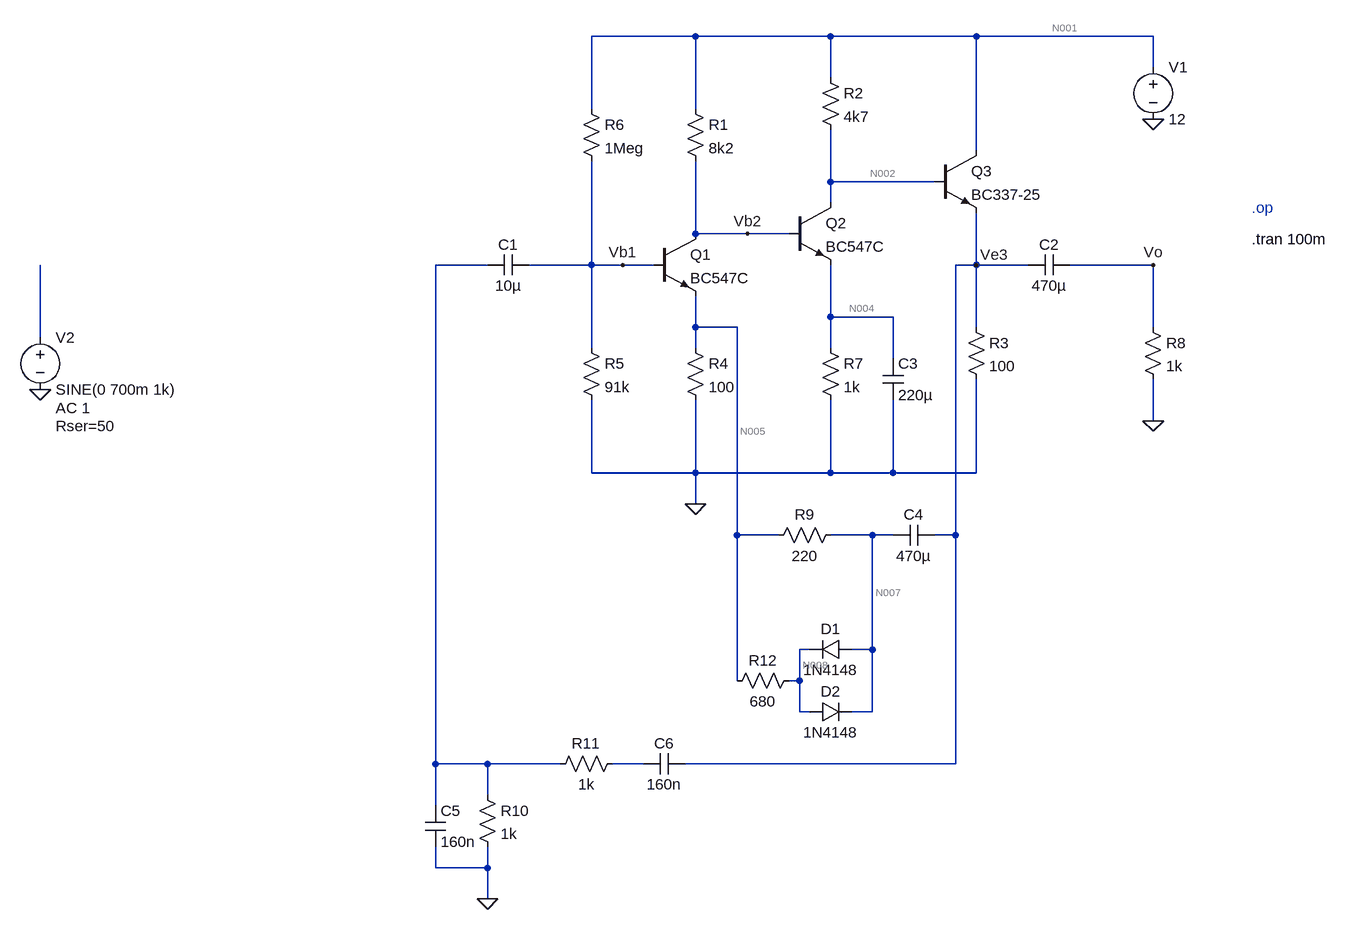
[diagram p0: schematic oscilador wien con bjts.asc]
oscilador wien con bjts.asc, the LTspice schematic file:
Version 4
SHEET 1 1052 1172
WIRE 64 -176 -96 -176
WIRE 272 -176 64 -176
WIRE 496 -176 272 -176
WIRE 768 -176 496 -176
WIRE 768 -128 768 -176
WIRE 272 -112 272 -176
WIRE -96 -64 -96 -176
WIRE 64 -64 64 -176
WIRE 496 0 496 -176
WIRE 272 48 272 -32
WIRE 432 48 272 48
WIRE 272 80 272 48
WIRE 64 128 64 16
WIRE 144 128 64 128
WIRE 208 128 144 128
WIRE -256 176 -336 176
WIRE -96 176 -96 16
WIRE -96 176 -192 176
WIRE -48 176 -96 176
WIRE 0 176 -48 176
WIRE 496 176 496 96
WIRE 496 176 464 176
WIRE 576 176 496 176
WIRE 768 176 640 176
WIRE 272 256 272 176
WIRE 368 256 272 256
WIRE 64 272 64 224
WIRE 128 272 64 272
WIRE 496 272 496 176
WIRE 768 272 768 176
WIRE -944 288 -944 176
WIRE -96 304 -96 176
WIRE 64 304 64 272
WIRE 272 304 272 256
WIRE 368 320 368 256
WIRE 768 416 768 352
WIRE -96 496 -96 384
WIRE 64 496 64 384
WIRE 64 496 -96 496
WIRE 272 496 272 384
WIRE 272 496 64 496
WIRE 368 496 368 384
WIRE 368 496 272 496
WIRE 496 496 496 352
WIRE 496 496 368 496
WIRE 64 544 64 496
WIRE 128 592 128 272
WIRE 192 592 128 592
WIRE 336 592 272 592
WIRE 368 592 336 592
WIRE 464 592 464 176
WIRE 464 592 432 592
WIRE 240 768 224 768
WIRE 336 768 336 592
WIRE 336 768 304 768
WIRE 128 816 128 592
WIRE 224 816 224 768
WIRE 224 816 208 816
WIRE 224 864 224 816
WIRE 240 864 224 864
WIRE 336 864 336 768
WIRE 336 864 304 864
WIRE -336 944 -336 176
WIRE -256 944 -336 944
WIRE -144 944 -256 944
WIRE -16 944 -64 944
WIRE 464 944 464 592
WIRE 464 944 48 944
WIRE -256 992 -256 944
WIRE -336 1008 -336 944
WIRE -336 1104 -336 1072
WIRE -256 1104 -256 1072
WIRE -256 1104 -336 1104
WIRE -256 1152 -256 1104
FLAG 768 -48 0
FLAG 64 544 0
FLAG -48 176 Vb1
FLAG 144 128 Vb2
FLAG 496 176 Ve3
FLAG -944 368 0
FLAG 768 416 0
FLAG 768 176 Vo
FLAG -256 1152 0
SYMBOL npn 0 128 R0
SYMATTR InstName Q1
SYMATTR Value BC547C
SYMBOL npn 208 80 R0
SYMATTR InstName Q2
SYMATTR Value BC547C
SYMBOL npn 432 0 R0
SYMATTR InstName Q3
SYMATTR Value BC337-25
SYMBOL res 48 -80 R0
SYMATTR InstName R1
SYMATTR Value 8k2
SYMBOL res 256 -128 R0
SYMATTR InstName R2
SYMATTR Value 4k7
SYMBOL res 480 256 R0
SYMATTR InstName R3
SYMATTR Value 100
SYMBOL res 48 288 R0
SYMATTR InstName R4
SYMATTR Value 100
SYMBOL res -112 288 R0
SYMATTR InstName R5
SYMATTR Value 91k
SYMBOL res -112 -80 R0
SYMATTR InstName R6
SYMATTR Value 1Meg
SYMBOL res 256 288 R0
SYMATTR InstName R7
SYMATTR Value 1k
SYMBOL voltage 768 -144 R0
WINDOW 123 0 0 Left 0
WINDOW 39 0 0 Left 0
SYMATTR InstName V1
SYMATTR Value 12
SYMBOL cap -192 160 R90
WINDOW 0 0 32 VBottom 2
WINDOW 3 32 32 VTop 2
SYMATTR InstName C1
SYMATTR Value 10µ
SYMBOL cap 640 160 R90
WINDOW 0 0 32 VBottom 2
WINDOW 3 32 32 VTop 2
SYMATTR InstName C2
SYMATTR Value 470µ
SYMBOL res 752 256 R0
SYMATTR InstName R8
SYMATTR Value 1k
SYMBOL voltage -944 272 R0
WINDOW 123 24 124 Left 2
WINDOW 39 24 152 Left 2
SYMATTR InstName V2
SYMATTR Value SINE(0 700m 1k)
SYMATTR Value2 AC 1
SYMATTR SpiceLine Rser=50
SYMBOL cap 352 320 R0
SYMATTR InstName C3
SYMATTR Value 220µ
SYMBOL res 288 576 R90
WINDOW 0 0 56 VBottom 2
WINDOW 3 32 56 VTop 2
SYMATTR InstName R9
SYMATTR Value 220
SYMBOL cap 432 576 R90
WINDOW 0 0 32 VBottom 2
WINDOW 3 32 32 VTop 2
SYMATTR InstName C4
SYMATTR Value 470µ
SYMBOL res -272 976 R0
SYMATTR InstName R10
SYMATTR Value 1k
SYMBOL res -48 928 R90
WINDOW 0 0 56 VBottom 2
WINDOW 3 32 56 VTop 2
SYMATTR InstName R11
SYMATTR Value 1k
SYMBOL cap -352 1008 R0
SYMATTR InstName C5
SYMATTR Value 160n
SYMBOL cap 48 928 R90
WINDOW 0 0 32 VBottom 2
WINDOW 3 32 32 VTop 2
SYMATTR InstName C6
SYMATTR Value 160n
SYMBOL diode 304 752 R90
WINDOW 0 0 32 VBottom 2
WINDOW 3 32 32 VTop 2
SYMATTR InstName D1
SYMATTR Value 1N4148
SYMBOL diode 240 880 R270
WINDOW 0 32 32 VTop 2
WINDOW 3 0 32 VBottom 2
SYMATTR InstName D2
SYMATTR Value 1N4148
SYMBOL res 224 800 R90
WINDOW 0 0 56 VBottom 2
WINDOW 3 32 56 VTop 2
SYMATTR InstName R12
SYMATTR Value 680
TEXT 920 88 Left 2 ;.op
TEXT 920 136 Left 2 !.tran 100m

The netlist it stands for:
* oscilador wien con bjts.asc
Q1 Vb2 Vb1 N005 0 BC547C
Q2 N002 Vb2 N004 0 BC547C
Q3 N001 N002 Ve3 0 BC337-25
R1 N001 Vb2 8k2
R2 N001 N002 4k7
R3 Ve3 0 100
R4 N005 0 100
R5 Vb1 0 91k
R6 N001 Vb1 1Meg
R7 N004 0 1k
V1 N001 0 12
C1 Vb1 N003 10µ
C2 Vo Ve3 470µ
R8 Vo 0 1k
V2 N006 0 SINE(0 700m 1k) AC 1 Rser=50
C3 N004 0 220µ
R9 N007 N005 220
C4 Ve3 N007 470µ
R10 N003 0 1k
R11 N009 N003 1k
C5 N003 0 160n
C6 Ve3 N009 160n
D1 N007 N008 1N4148
D2 N008 N007 1N4148
R12 N008 N005 680
.model D D
.lib standard.dio
.model NPN NPN
.model PNP PNP
.lib standard.bjt
* .op
.tran 100m
.backanno
.end

* Results of the author's LTspice run, read from the files saved beside the schematic
* Operating Point, zero values left out:
*   V(vb2) = 1.222 V
*   V(vb1) = 760.5 mV
*   V(n005) = 131.6 mV
*   V(n002) = 7.856 V
*   V(n004) = 616.1 mV
*   V(n001) = 12 V
*   V(ve3) = 7.121 V
*   V(n007) = 131.6 mV
*   V(n008) = 131.6 mV
*   Ic(Q1) = 1.313 mA
*   Ib(Q1) = 2.882 µA
*   Ie(Q1) = -1.316 mA
*   Ic(Q2) = 614.9 µA
*   Ib(Q2) = 1.204 µA
*   Ie(Q2) = -616.1 µA
*   Ic(Q3) = 70.94 mA
*   Ib(Q3) = 266.9 µA
*   Ie(Q3) = -71.21 mA
*   I(R1) = 1.314 mA
*   I(R2) = 881.8 µA
*   I(R3) = 71.21 mA
*   I(R4) = 1.316 mA
*   I(R5) = 8.357 µA
*   I(R6) = 11.24 µA
*   I(R7) = 616.1 µA
*   I(V1) = -73.15 mA
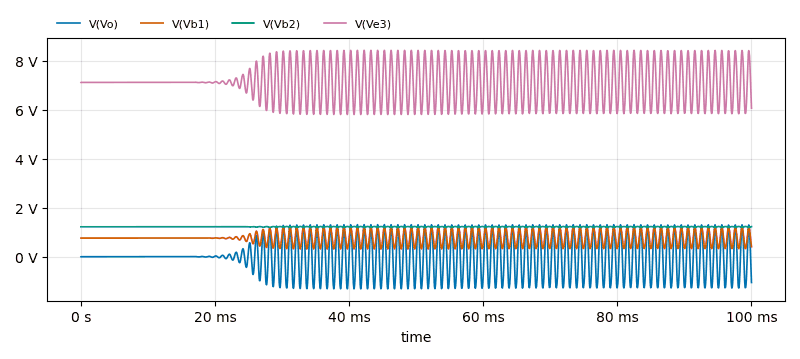
[diagram p1: Transient Analysis of oscilador wien con bjts.asc, plotted from the saved traces]
* Transient Analysis, 1 run:
*   V(Vo): min -1.31 V, max 1.309 V, average 2.439 mV, rms 800.3 mV, last -1.053 V
*   V(Vb1): min 318.4 mV, max 1.202 V, average 761.4 mV, rms 806.3 mV, last 412.6 mV
*   V(Vb2): min 1.198 V, max 1.235 V, average 1.22 V, rms 1.22 V, last 1.232 V
*   V(Ve3): min 5.811 V, max 8.43 V, average 7.124 V, rms 7.168 V, last 6.068 V